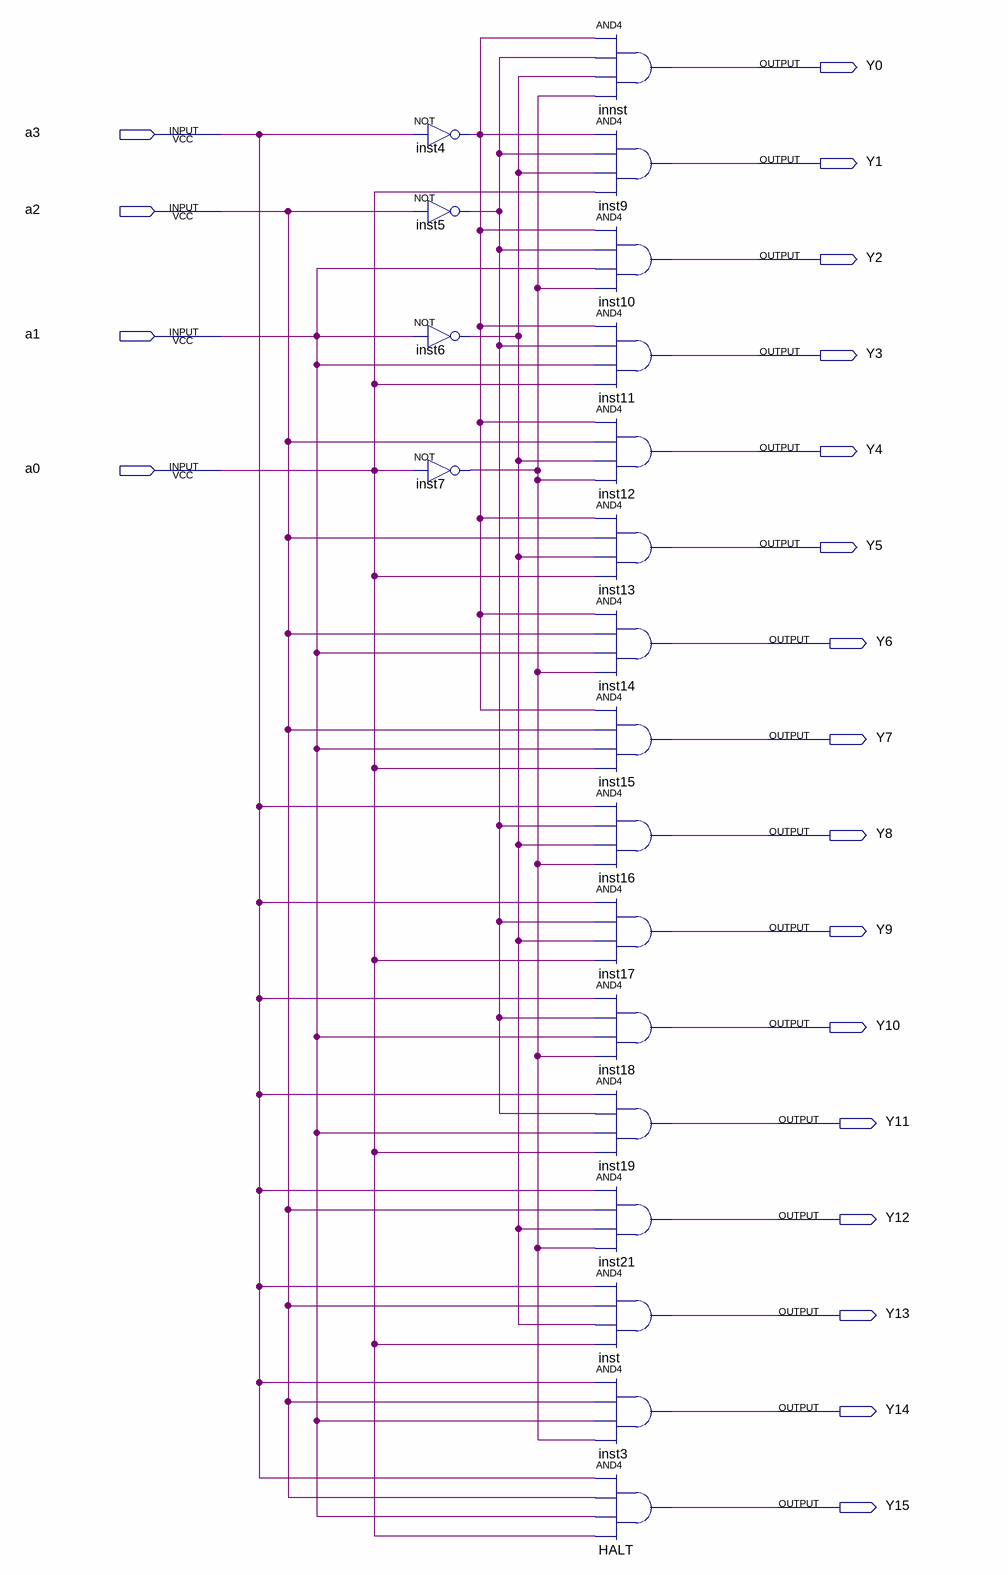
[diagram p0: schematic sheet]
// Quartus schematic 4-16Decoder.bdf as structural Verilog: 20 symbols, 20 pins
module \4-16Decoder  (
  input  a3,
  input  a2,
  input  a1,
  input  a0,
  output Y0,
  output Y1,
  output Y2,
  output Y3,
  output Y4,
  output Y5,
  output Y6,
  output Y7,
  output Y8,
  output Y9,
  output Y10,
  output Y11,
  output Y12,
  output Y13,
  output Y14,
  output Y15
);

  wire inst4_out, inst5_out, inst6_out, inst7_out;

  not inst4 (inst4_out, a3);
  not inst5 (inst5_out, a2);
  not inst6 (inst6_out, a1);
  not inst7 (inst7_out, a0);
  and innst (Y0, inst4_out, inst5_out, inst6_out, inst7_out);
  and inst9 (Y1, inst4_out, inst5_out, inst6_out, a0);
  and inst10 (Y2, inst4_out, inst5_out, a1, inst7_out);
  and inst11 (Y3, inst4_out, inst5_out, a1, a0);
  and inst12 (Y4, inst4_out, a2, inst6_out, inst7_out);
  and inst13 (Y5, inst4_out, a2, inst6_out, a0);
  and inst14 (Y6, inst4_out, a2, a1, inst7_out);
  and inst15 (Y7, inst4_out, a2, a1, a0);
  and inst16 (Y8, a3, inst5_out, inst6_out, inst7_out);
  and inst17 (Y9, a3, inst5_out, inst6_out, a0);
  and inst18 (Y10, a3, inst5_out, a1, inst7_out);
  and inst19 (Y11, a3, inst5_out, a1, a0);
  and inst21 (Y12, a3, a2, inst6_out, inst7_out);
  and inst (Y13, a3, a2, inst6_out, a0);
  and inst3 (Y14, a3, a2, a1, inst7_out);
  and HALT (Y15, a3, a2, a1, a0);
endmodule
